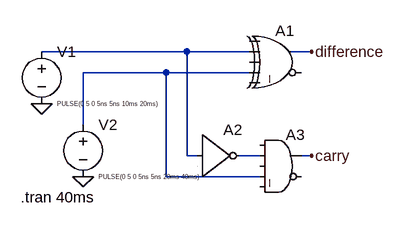
[diagram p0: schematic fullsubtractor.asc]
fullsubtractor.asc, the LTspice schematic file:
Version 4.1
SHEET 1 880 680
WIRE 224 96 0 96
WIRE 320 96 224 96
WIRE 416 96 384 96
WIRE 192 128 64 128
WIRE 320 128 192 128
WIRE 64 208 64 128
WIRE 224 256 224 96
WIRE 240 256 224 256
WIRE 336 256 304 256
WIRE 416 256 400 256
WIRE 192 288 192 128
WIRE 336 288 192 288
FLAG 0 176 0
FLAG 64 288 0
FLAG 416 96 difference
FLAG 416 256 carry
SYMBOL voltage 0 80 R0
WINDOW 3 24 96 Left 0
WINDOW 123 0 0 Left 0
WINDOW 39 0 0 Left 0
SYMATTR Value PULSE(0 5 0 5ns 5ns 10ms 20ms)
SYMATTR InstName V1
SYMBOL voltage 64 192 R0
WINDOW 3 24 96 Left 0
WINDOW 123 0 0 Left 0
WINDOW 39 0 0 Left 0
SYMATTR Value PULSE(0 5 0 5ns 5ns 20ms 40ms)
SYMATTR InstName V2
SYMBOL Digital\\xor 368 48 R0
SYMATTR InstName A1
SYMBOL Digital\\inv 240 192 R0
SYMATTR InstName A2
SYMBOL Digital\\and 368 208 R0
SYMATTR InstName A3
TEXT -32 320 Left 2 !.tran 40ms

The netlist it stands for:
* fullsubtractor.asc
V1 N001 0 PULSE(0 5 0 5ns 5ns 10ms 20ms)
V2 N002 0 PULSE(0 5 0 5ns 5ns 20ms 40ms)
A1 0 N001 0 N002 0 0 difference 0 XOR
A2 N001 0 0 0 0 N003 0 0 BUF
A3 0 N003 0 N002 0 0 carry 0 AND
.tran 40ms
.backanno
.end